# EasyEDA schematic power_supply_7805.json
TITLE: Sheet_1; REV: 1.0; Date: 2026-06-10; Sheet: 1/1; Drawn By: Alwin_Josh; Company: Alwin
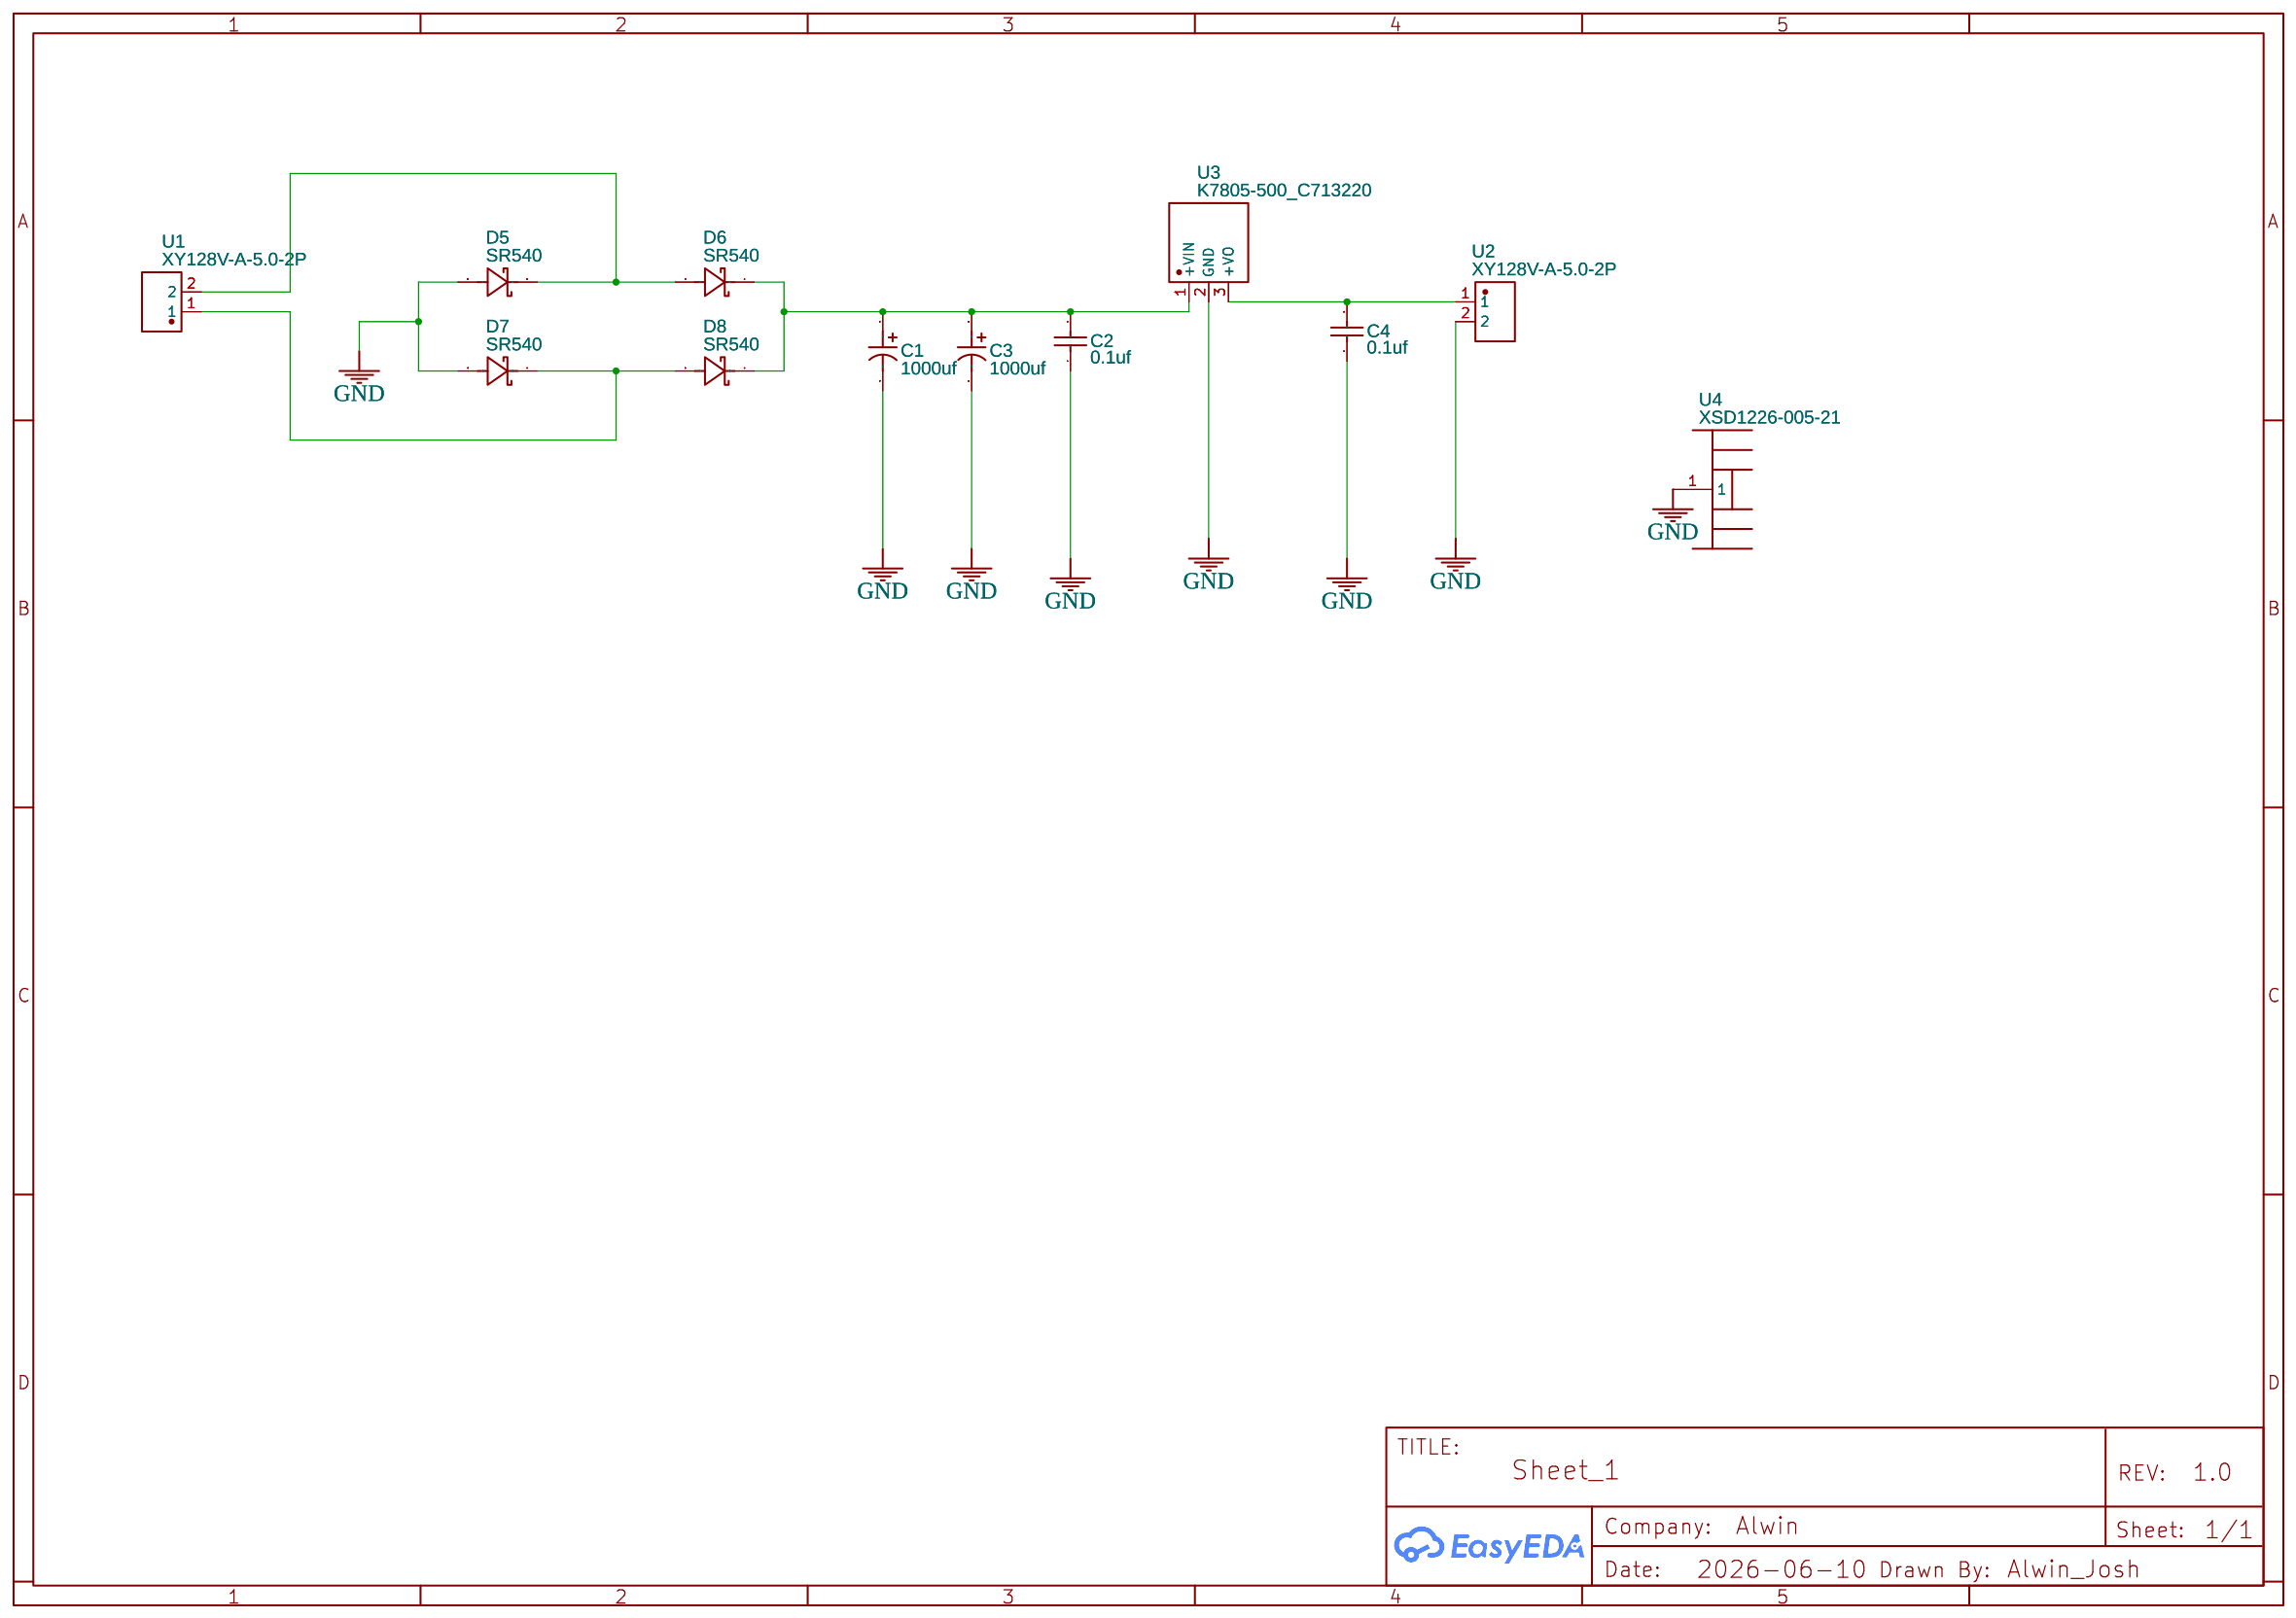
[diagram p0: schematic sheet]

## Parts
C1  1000uf  [CAP-TH_BD6.3-P2.50-D0.6-FD_RYHS16V1000UF6X15]
C2  0.1uf  [RAD-0.2]
C3  1000uf  [CAP-TH_BD6.3-P2.50-D0.6-FD_RYHS16V1000UF6X15]
C4  0.1uf  [RAD-0.2]
D5  SR540  [DO-27_BD5.8-L9.2-P15.10-D1.2-RD]
D6  SR540  [DO-27_BD5.8-L9.2-P15.10-D1.2-RD]
D7  SR540  [DO-27_BD5.8-L9.2-P15.10-D1.2-RD]
D8  SR540  [DO-27_BD5.8-L9.2-P15.10-D1.2-RD]
U1  XY128V-A-5.0-2P  [CONN-TH_XY128V-A-5.0-2P]
U2  XY128V-A-5.0-2P  [CONN-TH_XY128V-A-5.0-2P]
U3  K7805-500_C713220  [TO-220_L10.2-W4.6-P2.54_LR7805]
U4  XSD1226-005-21  [HEATSINK-TH_L15.5-W10.5-XSD1226-005]

## Library data of the parts
C1 C3 = RVT2A4R7M0607ZY: Supplier: LCSC; Supplier Part: C46527562; Manufacturer: ChengTao(诚韬); Contributor: lcsc
C2 C4 = 0.1uf: Supplier Part: undefined; Supplier: LCSC; Manufacturer: LCSC; Manufacturer Part: CT4-0805Y104M500
D5-D8 = SR540_C22448098: Supplier: LCSC; Supplier Part: C22448098; Manufacturer: XUMAO(旭茂微); JLCPCB Part Class: Extended Part; Contributor: lcsc
U1 U2 = XY128V-A-5.0-2P: Contributor: LCSC; Supplier: LCSC; Supplier Part: C557663; Manufacturer: XINLAIYA(新莱亚); JLCPCB Part Class: Extended Part
U3 = K7805-500_C713220: Contributor: LCSC; Supplier: LCSC; Supplier Part: C713220; Manufacturer: rlt; Manufacturer Part: K7805-500; JLCPCB Part Class: Extended Part
U4 = XSD1226-005-21: Supplier: LCSC; Supplier Part: C54320987; Manufacturer: XSD(鑫顺达); JLCPCB Part Class: Extended Part; Contributor: lcsc

## Nets
GND: C1.2 C2.1 C3.2 C4.1 D5.2(A) D7.2(A) U2.2 U3.2(GND) U4.1
Net-(C1-1): C1.1 C2.2 C3.1 D6.1(C) D8.1(C) U3.1(+VIN)
Net-(C4-2): C4.2 U2.1 U3.3(+VO)
Net-(D5-1): D5.1(C) D6.2(A) U1.2
Net-(D7-1): D7.1(C) D8.2(A) U1.1
